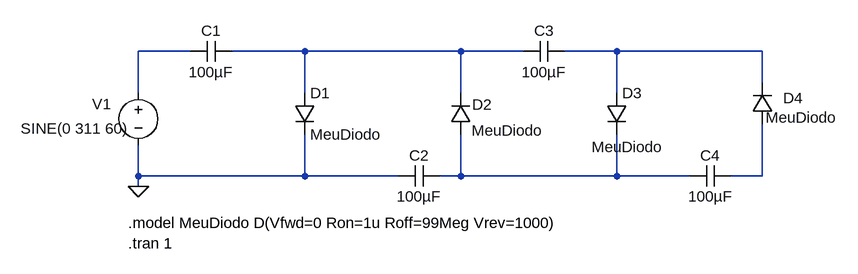
[diagram p0: schematic Diodo-Multiplicador-LTSpice.asc]
Diodo-Multiplicador-LTSpice.asc, the LTspice schematic file:
Version 4
SHEET 1 1332 680
WIRE 64 32 -16 32
WIRE 240 32 128 32
WIRE 480 32 240 32
WIRE 576 32 480 32
WIRE 720 32 640 32
WIRE 944 32 720 32
WIRE 944 80 944 32
WIRE -16 96 -16 32
WIRE 240 96 240 32
WIRE 480 96 480 32
WIRE 720 96 720 32
WIRE -16 224 -16 176
WIRE 240 224 240 160
WIRE 240 224 -16 224
WIRE 384 224 240 224
WIRE 480 224 480 160
WIRE 480 224 448 224
WIRE 720 224 720 160
WIRE 720 224 480 224
WIRE 832 224 720 224
WIRE 944 224 944 144
WIRE 944 224 896 224
WIRE -16 240 -16 224
FLAG -16 240 0
SYMBOL voltage -16 80 R0
WINDOW 123 0 0 Left 2
WINDOW 39 0 0 Left 2
WINDOW 0 -71 33 Left 2
WINDOW 3 -181 71 Left 2
SYMATTR InstName V1
SYMATTR Value SINE(0 311 60)
SYMBOL diode 224 96 R0
SYMATTR InstName D1
SYMATTR Value MeuDiodo
SYMBOL cap 128 16 R90
WINDOW 0 0 32 VBottom 2
WINDOW 3 32 32 VTop 2
SYMATTR InstName C1
SYMATTR Value 100µF
SYMBOL cap 448 208 R90
WINDOW 0 0 32 VBottom 2
WINDOW 3 32 32 VTop 2
SYMATTR InstName C2
SYMATTR Value 100µF
SYMBOL cap 640 16 R90
WINDOW 0 0 32 VBottom 2
WINDOW 3 32 32 VTop 2
SYMATTR InstName C3
SYMATTR Value 100µF
SYMBOL cap 896 208 R90
WINDOW 0 0 32 VBottom 2
WINDOW 3 32 32 VTop 2
SYMATTR InstName C4
SYMATTR Value 100µF
SYMBOL diode 496 160 R180
WINDOW 0 -32 46 Left 2
WINDOW 3 -111 6 Left 2
SYMATTR InstName D2
SYMATTR Value MeuDiodo
SYMBOL diode 704 96 R0
WINDOW 3 -23 83 Left 2
SYMATTR InstName D3
SYMATTR Value MeuDiodo
SYMBOL diode 960 144 R180
WINDOW 0 -47 40 Left 2
WINDOW 3 -99 10 Left 2
SYMATTR InstName D4
SYMATTR Value MeuDiodo
TEXT -32 328 Left 2 !.tran 1
TEXT -32 296 Left 2 !.model MeuDiodo D(Vfwd=0 Ron=1u Roff=99Meg Vrev=1000)

The netlist it stands for:
* Diodo-Multiplicador-LTSpice.asc
V1 N001 0 SINE(0 311 60)
D1 N002 0 MeuDiodo
C1 N002 N001 100µF
C2 N004 0 100µF
C3 N003 N002 100µF
C4 N005 N004 100µF
D2 N004 N002 MeuDiodo
D3 N003 N004 MeuDiodo
D4 N005 N003 MeuDiodo
.model D D
.lib standard.dio
.tran 1
.model MeuDiodo D(Vfwd=0 Ron=1u Roff=99Meg Vrev=1000)
.backanno
.end